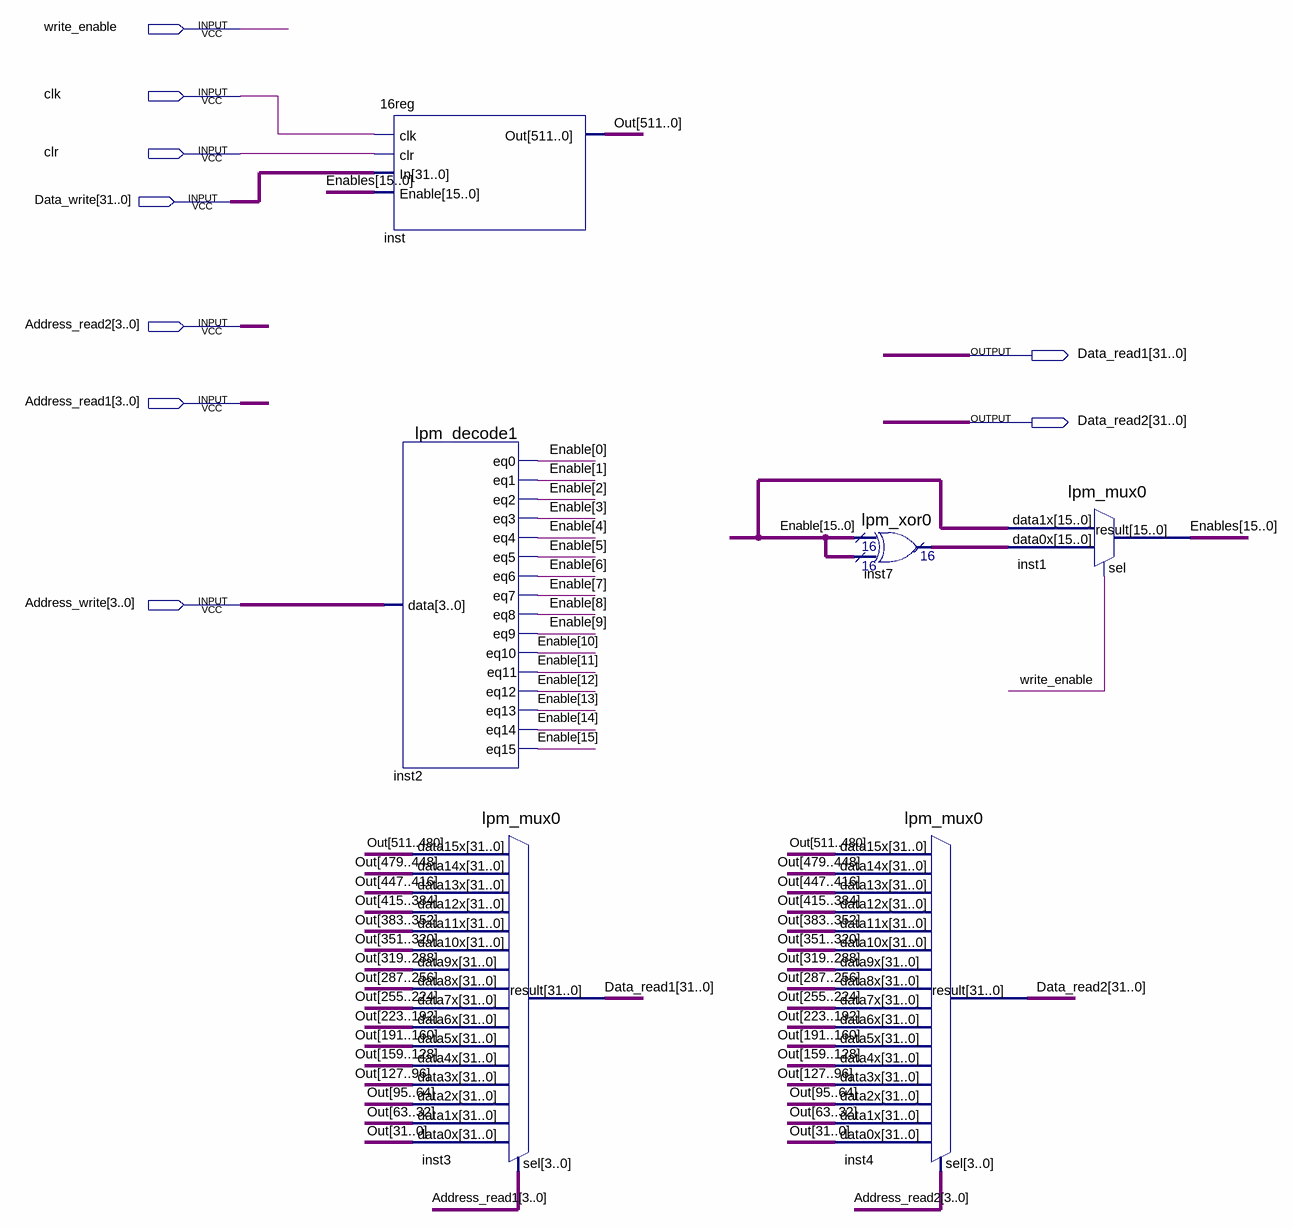
[diagram p0: schematic sheet]
// Quartus schematic 16regFile.bdf as structural Verilog: 6 symbols, 9 pins
module \16regFile  (
  input  write_enable,
  input  clk,
  input  clr,
  input  [31:0] Data_write,
  input  [3:0] Address_read2,
  input  [3:0] Address_read1,
  input  [3:0] Address_write,
  output [31:0] Data_read1,
  output [31:0] Data_read2
);

  wire [15:0] Enable, Enables, inst7_result;
  wire [511:0] Out;

  \16reg  inst (.clk(clk), .clr(clr), .In(Data_write), .Enable(Enables), .Out(Out));
  lpm_decode1 inst2 (
    .data(Address_write), .eq0(Enable[0]), .eq1(Enable[1]), .eq2(Enable[2]), .eq3(Enable[3]),
    .eq4(Enable[4]), .eq5(Enable[5]), .eq6(Enable[6]), .eq7(Enable[7]), .eq8(Enable[8]), .eq9(Enable[9]),
    .eq10(Enable[10]), .eq11(Enable[11]), .eq12(Enable[12]), .eq13(Enable[13]), .eq14(Enable[14]),
    .eq15(Enable[15]));
  lpm_mux0 inst3 (
    .data15x(Out[511:480]), .data14x(Out[479:448]), .data13x(Out[447:416]), .data12x(Out[415:384]),
    .data11x(Out[383:352]), .data10x(Out[351:320]), .data9x(Out[319:288]), .data8x(Out[287:256]),
    .data7x(Out[255:224]), .data6x(Out[223:192]), .data5x(Out[191:160]), .data4x(Out[159:128]),
    .data3x(Out[127:96]), .data2x(Out[95:64]), .data1x(Out[63:32]), .data0x(Out[31:0]), .sel(Address_read1),
    .result(Data_read1));
  lpm_mux0 inst4 (
    .data15x(Out[511:480]), .data14x(Out[479:448]), .data13x(Out[447:416]), .data12x(Out[415:384]),
    .data11x(Out[383:352]), .data10x(Out[351:320]), .data9x(Out[319:288]), .data8x(Out[287:256]),
    .data7x(Out[255:224]), .data6x(Out[223:192]), .data5x(Out[191:160]), .data4x(Out[159:128]),
    .data3x(Out[127:96]), .data2x(Out[95:64]), .data1x(Out[63:32]), .data0x(Out[31:0]), .sel(Address_read2),
    .result(Data_read2));
  lpm_xor0 inst7 (.data0x(Enable), .data1x(Enable), .result(inst7_result));
  lpm_mux0 inst1 (.data1x(Enable), .data0x(inst7_result), .sel(write_enable), .result(Enables));
endmodule
